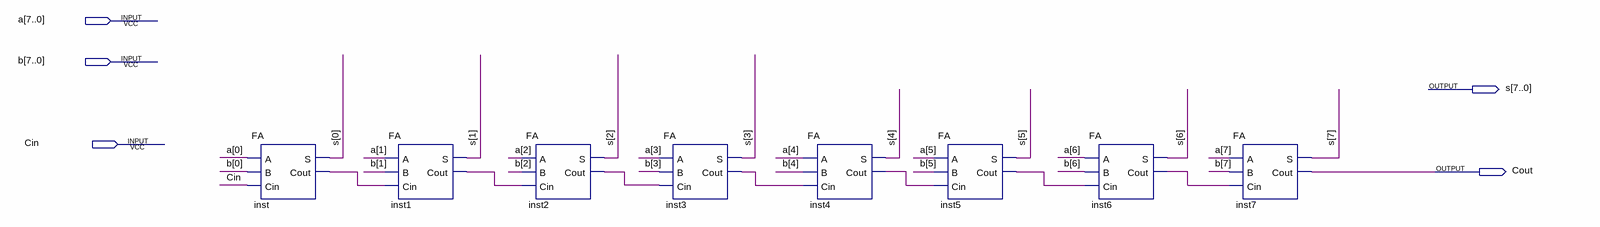
[diagram p0: schematic sheet]
// Quartus schematic RCA.bdf as structural Verilog: 8 symbols, 5 pins
module RCA (
  input  [7:0] a,
  input  [7:0] b,
  input  Cin,
  output [7:0] s,
  output Cout
);

  wire inst1_cout, inst2_cout, inst3_cout, inst4_cout, inst5_cout, inst6_cout, inst_cout;

  FA inst (.A(a[0]), .B(b[0]), .Cin(Cin), .S(s[0]), .Cout(inst_cout));
  FA inst1 (.A(a[1]), .B(b[1]), .Cin(inst_cout), .S(s[1]), .Cout(inst1_cout));
  FA inst2 (.A(a[2]), .B(b[2]), .Cin(inst1_cout), .S(s[2]), .Cout(inst2_cout));
  FA inst3 (.A(a[3]), .B(b[3]), .Cin(inst2_cout), .S(s[3]), .Cout(inst3_cout));
  FA inst4 (.A(a[4]), .B(b[4]), .Cin(inst3_cout), .S(s[4]), .Cout(inst4_cout));
  FA inst5 (.A(a[5]), .B(b[5]), .Cin(inst4_cout), .S(s[5]), .Cout(inst5_cout));
  FA inst6 (.A(a[6]), .B(b[6]), .Cin(inst5_cout), .S(s[6]), .Cout(inst6_cout));
  FA inst7 (.A(a[7]), .B(b[7]), .Cin(inst6_cout), .S(s[7]), .Cout(Cout));
endmodule
